# Altium schematic sheet KEY_LED.schdoc: =
size A4; Symbol: Sheet-Symbol_A4; Company: 嘉立创EDA; Version: V1.0; Page Size: A4; @Project Name: RK3568B2地瓜派; @Page Count: 26; @Update Date: 2025-09-11; @Create Date: 2025-09-11; @Schematic Name: Schematic1; @Page No: 18; @Page Name: KEY/LED; Device: Sheet-Symbol_A4; Border: 1; Title Block Position: 3; Width: 1170; Height: 825; Region Start: 1; X Region Count: 6; Y Region Count: 4; Blade Width: 10; @Board Name: Board1; @Create Time: 22:14:46; @Update Time: 22:15:06; Organization: ORGANIZATION; Address1: ADDRESS 1; Address2: ADDRESS 2; Address3: ADDRESS 3; Address4: ADDRESS 4; SheetNumber: 25; SheetTotal: 28
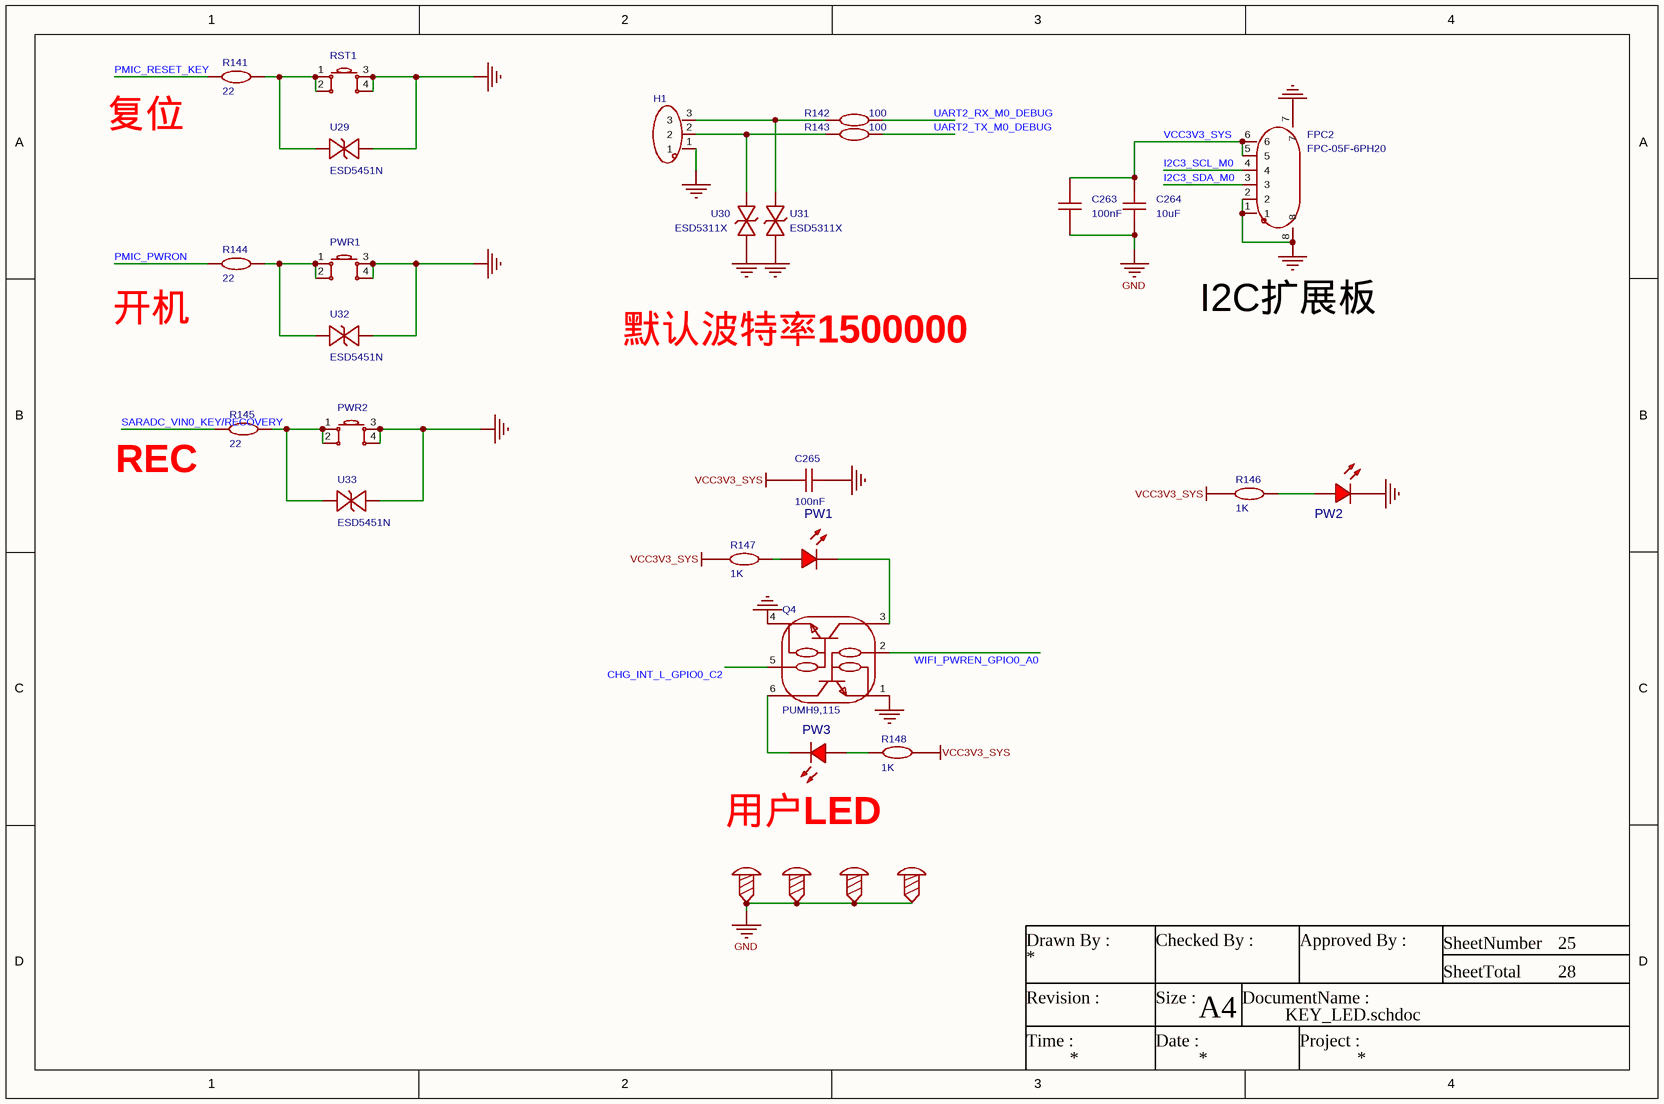
[diagram p0: KEY_LED.schdoc]

## Parts
C263  100nF  [C0603]
C264  10uF  [C0603]
C265  100nF  [C0603]
FPC2  FPC-05F-6PH20  [FPC-SMD_6P-P0.50_XUNPU_FPC-05F-6PH20]
H1  (no value)  [HDR-TH_3P-P2.54-V-M]
PW1  (no value)  [LED_0402]
PW2  (no value)  [LED_0402]
PW3  (no value)  [LED_0402]
PWR1  (no value)  [Key_SMD_4.2x3.2x2.5]
PWR2  (no value)  [Key_SMD_4.2x3.2x2.5]
Q4  PUMH9,115  [SOT-363_L2.0-W1.3-P0.65-LS2.1-BL]
R141  22  [R0402]
R142  100  [R0402]
R143  100  [R0402]
R144  22  [R0402]
R145  22  [R0402]
R146  1K  [R0402]
R147  1K  [R0402]
R148  1K  [R0402]
RST1  (no value)  [Key_SMD_4.2x3.2x2.5]
SCREW1  (no value)  [M3螺丝]
SCREW2  (no value)  [M3螺丝]
SCREW3  (no value)  [M3螺丝]
SCREW4  (no value)  [M3螺丝]
U29  ESD5451N  [X1-DFN1006-2_L1.0-W0.6-P0.65-BI]
U30  ESD5311X  [DFN1006-2L-BI]
U31  ESD5311X  [DFN1006-2L-BI]
U32  ESD5451N  [X1-DFN1006-2_L1.0-W0.6-P0.65-BI]
U33  ESD5451N  [X1-DFN1006-2_L1.0-W0.6-P0.65-BI]

## Nets
GND: C263.1 C264.1 C265.1 FPC2.1 FPC2.2 FPC2.7 FPC2.8 H1.1 PW2.1(C) PWR1.3 PWR1.4 PWR2.3 PWR2.4 Q4.1(E1) Q4.4(E2) RST1.3 RST1.4 SCREW1.1 SCREW2.1 SCREW3.1 SCREW4.1 U29.2 U30.2 U31.2 U32.2 U33.2
VCC3V3_SYS: C263.2 C264.2 C265.2 FPC2.5 FPC2.6 R146.1 R147.2 R148.1
CHG_INT_L_GPIO0_C2: Q4.5(B2)
I2C3_SCL_M0: FPC2.4
I2C3_SDA_M0: FPC2.3
PMIC_PWRON: R144.1
PMIC_RESET_KEY: R141.1
SARADC_VIN0_KEY/RECOVERY: R145.1
UART2_RX_M0_DEBUG: R142.2
UART2_TX_M0_DEBUG: R143.2
WIFI_PWREN_GPIO0_A0: Q4.2(B1)
NetH1_2: H1.2 R143.1 U30.1
NetH1_3: H1.3 R142.1 U31.1
NetPW1_1: PW1.1(C) Q4.3(C2)
NetPW1_2: PW1.2(A) R147.1
NetPW2_2: PW2.2(A) R146.2
NetPW3_1: PW3.1(C) Q4.6(C1)
NetPW3_2: PW3.2(A) R148.2
NetPWR1_1: PWR1.1 PWR1.2 R144.2 U32.1
NetPWR2_1: PWR2.1 PWR2.2 R145.2 U33.1
NetR141_2: R141.2 RST1.1 RST1.2 U29.1

## Notes on the sheet
- (near R141) 复位
- (near R144) 开机
- 默认波特率1500000
- (near FPC2) I2C扩展板
- (near R145) REC
- 用户LED
- Drawn By :
- Checked By :
- Approved By :
- SheetNumber
- SheetTotal
- Revision :
- Time :
- Size :
- Date :
- A4
- DocumentName :
- Project :

## Library data of the parts
C263 C264 = CAP_0603: Symbol: Capacitance; 3D Model: ac125912035d415993ca9572d50418b1聨0819f05c4eef4c71ace90d822a990e87; 3D Model Transform: 62.992,31.496,0,0,0,0,0,0,0; ConvertToPcb: yes; ModelName: C0603_L1.6-W0.8-H0.8; Device: CAP_0603; Supplier Footprint: 0603; AddInBom: yes; FootprintName: C0603
  C263: Value: 100nF
  C264: Value: 10uF
C265 = CAP_0603: Symbol: Capacitance; ConvertToPcb: yes; ModelId: ac125912035d415993ca9572d50418b1; ModelName: C0603_L1.6-W0.8-H0.8; ModelTransform: 62.992,31.496,0,0,0,0,0,0,0; Device: CAP_0603; AddInBom: yes; Supplier Footprint: 0603; FootprintName: C0603; Value: 100nF
FPC2 = FPC-05F-6PH20: 锁定特性:翻盖式;触点类型:下接;触点数量:6P;间距:0.5mm;安装类型:卧贴;工作温度范围:-25℃~+85℃;; Manufacturer: XUNPU(讯普); 3D Model: f0153d283bb647ab8cc6ddf5c8ee15be; 3D Model Transform: 291.338,220.472,0,0,0,0,-0.001,-45.276,0; Locking Feature: 翻盖式; Number of Contacts: 6P; Pitch: 0.5mm; FFC, FCB Thickness: 0.3mm; AddInBom: yes; LCSC Part Name: 间距:0.5mm P数:6P 翻盖式 下接; Supplier Part: C2856796; Manufacturer Part: FPC-05F-6PH20; Supplier Footprint: SMD,P=0.5mm,卧贴; JLCPCB Part Class: 扩展库; Datasheet: https://atta.szlcsc.com/upload/public/pdf/source/20210922/16B003FB53336DDF6538142CC465AC4D.pdf; Supplier: LCSC; Contact Type: 下接; Mounting Type: 卧贴; Height Above Board: 2mm; Operating Temperature Range: -25℃~+85℃; Symbol: FPC-05F-6PH20; Device: FPC-05F-6PH20; ConvertToPcb: yes; FootprintName: FPC-SMD_6P-P0.50_XUNPU_FPC-05F-6PH20; ModelName: FPC-SMD_6P-P0.50_XUNPU_FPC-05F-6PH20
H1 = HDR-M_2.54_1x3P: AddInBom: yes; ModelId: bb473b6d38ff42a99216a4fcdbdcc4cb; ModelName: HDR-TH_3P-P2.54-M-LI-1X3P; ModelTransform: 299.9993964861481,99.99979882871602,454.3297999999999,0,0,0,0,0,-118.11024; Symbol: HDR-M_2.54_1x3P; Device: HDR-M_2.54_1x3P; ConvertToPcb: yes; FootprintName: HDR-TH_3P-P2.54-V-M; SupplierPart: C2937625; Supplier Footprint: 插件
PW1-PW3 = LED_0402-R: Symbol: LED_R; Convert to PCB: yes; 3D Model: ff479c6f784e45d5abe8f8ff531b4a70; 3D Model Transform: 39.4,19.7,15.76,180,0,0,0,0,0; ModelName: LED0402-RD_ORANGE; Device: LED_0402-R; Add into BOM: yes; Supplier Footprint: 0402; FootprintName: LED_0402
PWR1 RST1 = Key_SMD_4.2x3.2x2.5: Symbol: 轻触按键; ConvertToPcb: yes; ModelId: 38f4e5ae1c0a49d7a4c1f95a650cdbea聨0819f05c4eef4c71ace90d822a990e87; ModelName: KEY-SMD_4P-L4.2-W3.2-H2.5-LS4.6-P2.2; ModelTransform: 184.97,125.98,98.82,0,0,0,0,0,0; Device: Key_SMD_4.2x3.2x2.5; AddInBom: yes; Supplier Footprint: SMD; FootprintName: Key_SMD_4.2x3.2x2.5
PWR2 = Key_SMD_4.2x3.2x2.5: Symbol: 轻触按键; 3D Model: 38f4e5ae1c0a49d7a4c1f95a650cdbea聨0819f05c4eef4c71ace90d822a990e87; 3D Model Transform: 184.97,125.98,98.82,0,0,0,0,0,0; ConvertToPcb: yes; ModelName: KEY-SMD_4P-L4.2-W3.2-H2.5-LS4.6-P2.2; Device: Key_SMD_4.2x3.2x2.5; Supplier Footprint: SMD; AddInBom: yes; FootprintName: Key_SMD_4.2x3.2x2.5
Q4 = PUMH9,115: 晶体管类型:-;集射极击穿电压(Vceo):50V;集电极电流(Ic):100mA;功率(Pd):200mW;直流电流增益(hFE@Ic,Vce):100@5mA,5V;; Manufacturer: Nexperia(安世); AddInBom: yes; ModelId: ea15c7b026c54341854a7f0d9614aed9; ModelName: SOT-363-6P_L2.0-W1.3-H1.1-LS2.0-P0.65; ModelTransform: 83.17133,78.74,0,90,0,0,0,0,0; Collector-Emitter Breakdown Voltage (Vceo): 50V; Collector Current (Ic): 100mA; Power Dissipation (Pd): 200mW; Input Voltage (VI(on)@Ic,Vce): 800mV@1mA,0.3V; Input Voltage (VI(off)@Ic,Vce): 700mV@100uA,5V; Input Resistor: 10kΩ; Resistor Ratio: 4.7; Symbol: PUMH9,115; Device: PUMH9,115; LCSC Part Name: 耐压:50V 电流:100mA; SupplierPart: C426876; ManufacturerPart: PUMH9,115; Supplier Footprint: SOT-363; JLCPCB Part Class: 扩展库; Datasheet: https://atta.szlcsc.com/upload/public/pdf/source/20240724/03256FD06240C401B0BD478BA06DFF99.pdf; Supplier: LCSC; ConvertToPcb: yes; FootprintName: SOT-363_L2.0-W1.3-P0.65-LS2.1-BL; Transistor Type: -; DC Current Gain (hFE@Ic,Vce): 100@5mA,5V; Operating Temperature: -55℃~+150℃
R141 R144 R146-R148 = Res_0402: Symbol: 电阻; ConvertToPcb: yes; ModelId: 671aefced39d4c318694bba8bd8efd39; ModelName: R0402_L1.0-W0.5-H0.5; ModelTransform: 39.37,19.685,0,0,0,0,0,0.0005,0; Device: Res_0402; AddInBom: yes; Supplier Footprint: 0402; FootprintName: R0402
  R141 R144: Value: 22
  R146-R148: Value: 1K
R142 R143 = Res_0402: 3D Model: 671aefced39d4c318694bba8bd8efd39; 3D Model Transform: 39.37,19.685,0,0,0,0,0,0.0005,0; Symbol: 电阻; ConvertToPcb: yes; ModelName: R0402_L1.0-W0.5-H0.5; Value: 100; Device: Res_0402; AddInBom: yes; Supplier Footprint: 0402; FootprintName: R0402
R145 = Res_0402: Symbol: 电阻; 3D Model: 671aefced39d4c318694bba8bd8efd39; 3D Model Transform: 39.37,19.685,0,0,0,0,0,0.0005,0; ConvertToPcb: yes; ModelName: R0402_L1.0-W0.5-H0.5; Device: Res_0402; Value: 22; Supplier Footprint: 0402; AddInBom: yes; FootprintName: R0402
SCREW1-SCREW4 = M3螺丝: Symbol: 螺丝孔; ConvertToPcb: yes; Supplier Footprint: 插件; Device: M3螺丝; AddInBom: yes; FootprintName: M3螺丝
U29 U32 = ESD5451N_C2936977: 极性:双向;反向截止电压(Vrwm):5V;钳位电压:13V;峰值脉冲电流(Ipp):5.5A;峰值脉冲功率(Ppp):90W;击穿电压:8.4V;; Manufacturer: TECH PUBLIC(台舟); AddInBom: yes; ModelId: e1a2843302f940e8ac07b7d637792d48; ModelTransform: 39.37,23.622,0,0,0,0,0,0,0; Polarity: 双向; Reverse Stand-Off Voltage (Vrwm): 5V; Clamping Voltage: 13V; Peak Pulse Current (Ipp): 5.5A; Peak Pulse Power Dissipation (Ppp): 90W; Voltage - Breakdown: 8.4V; Reverse Leakage Current (Ir): 80nA; Number of Channels: 单路; level of protection: IEC 61000-4-2; Symbol: ESD5451N_C2936977; Device: ESD5451N_C2936977; LCSC Part Name: ESD二极管; SupplierPart: C2936977; ManufacturerPart: ESD5451N; Supplier Footprint: DFN1006-2; JLCPCB Part Class: 扩展库; Datasheet: https://item.szlcsc.com/datasheet/ESD5451N/3290324.html; Supplier: LCSC; ConvertToPcb: yes; FootprintName: X1-DFN1006-2_L1.0-W0.6-P0.65-BI; ModelName: X1-DFN1006-2_L1.0-W0.6-P0.65-BI; Operating Temperature: -55℃~+125℃; Type: ESD
U30 U31 = ESD5311X_C2844730: 极性:双向;反向截止电压(Vrwm):5V;最大钳位电压:21V;峰值脉冲电流(Ipp):4A;峰值脉冲功率(Ppp):80W;击穿电压:7.5V;; Manufacturer: TECH PUBLIC(台舟); AddInBom: yes; ModelId: 2bdbcca3b35b49c5a8ae725a08658930; ModelTransform: 40.1574,24.4094,0,0,0,0,0,0,0; polarity: 双向; Reverse Stand-Off Voltage (Vrwm): 5V; Maximum Clamping Voltage: 21V; Peak Pulse Current (Ipp): 4A; Peak Pulse Power Dissipation (Ppp): 80W; Breakdown Voltage: 7.5V; Reverse Leakage Current (Ir): 80nA; Number of Lines: 单路; level of protection: IEC 61000-4-2; Symbol: ESD5311X_C2844730; Device: ESD5311X_C2844730; LCSC Part Name: ESD5311X; SupplierPart: C2844730; ManufacturerPart: ESD5311X; Supplier Footprint: DFN1006-2; JLCPCB Part Class: 扩展库; Datasheet: https://atta.szlcsc.com/upload/public/pdf/source/20210709/C2844730_C8067B3CCE558E7D499244211FB5DC21.pdf; Supplier: LCSC; ConvertToPcb: yes; FootprintName: DFN1006-2L-BI; ModelName: DFN1006-2L-BI; Operating Temperature: -55℃~+125℃; Type: ESD
U33 = ESD5451N_C2936977: 极性:双向;反向截止电压(Vrwm):5V;钳位电压:13V;峰值脉冲电流(Ipp):5.5A;峰值脉冲功率(Ppp):90W;击穿电压:8.4V;; Manufacturer: TECH PUBLIC(台舟); 3D Model: e1a2843302f940e8ac07b7d637792d48; 3D Model Transform: 39.37,23.622,0,0,0,0,0,0,0; Polarity: 双向; Reverse Stand-Off Voltage (Vrwm): 5V; Clamping Voltage: 13V; Peak Pulse Current (Ipp): 5.5A; Peak Pulse Power Dissipation (Ppp): 90W; Voltage - Breakdown: 8.4V; Reverse Leakage Current (Ir): 80nA; Number of Channels: 单路; level of protection: IEC 61000-4-2; AddInBom: yes; Symbol: ESD5451N_C2936977; Device: ESD5451N_C2936977; LCSC Part Name: ESD二极管; Supplier Part: C2936977; Manufacturer Part: ESD5451N; Supplier Footprint: DFN1006-2; JLCPCB Part Class: 扩展库; Datasheet: https://item.szlcsc.com/datasheet/ESD5451N/3290324.html; Supplier: LCSC; Operating Temperature: -55℃~+125℃; Type: ESD; ConvertToPcb: yes; FootprintName: X1-DFN1006-2_L1.0-W0.6-P0.65-BI; ModelName: X1-DFN1006-2_L1.0-W0.6-P0.65-BI